# Altium schematic sheet PowerAndSafety.SchDoc
size A4; SheetNumber: 5; SheetTotal: 5
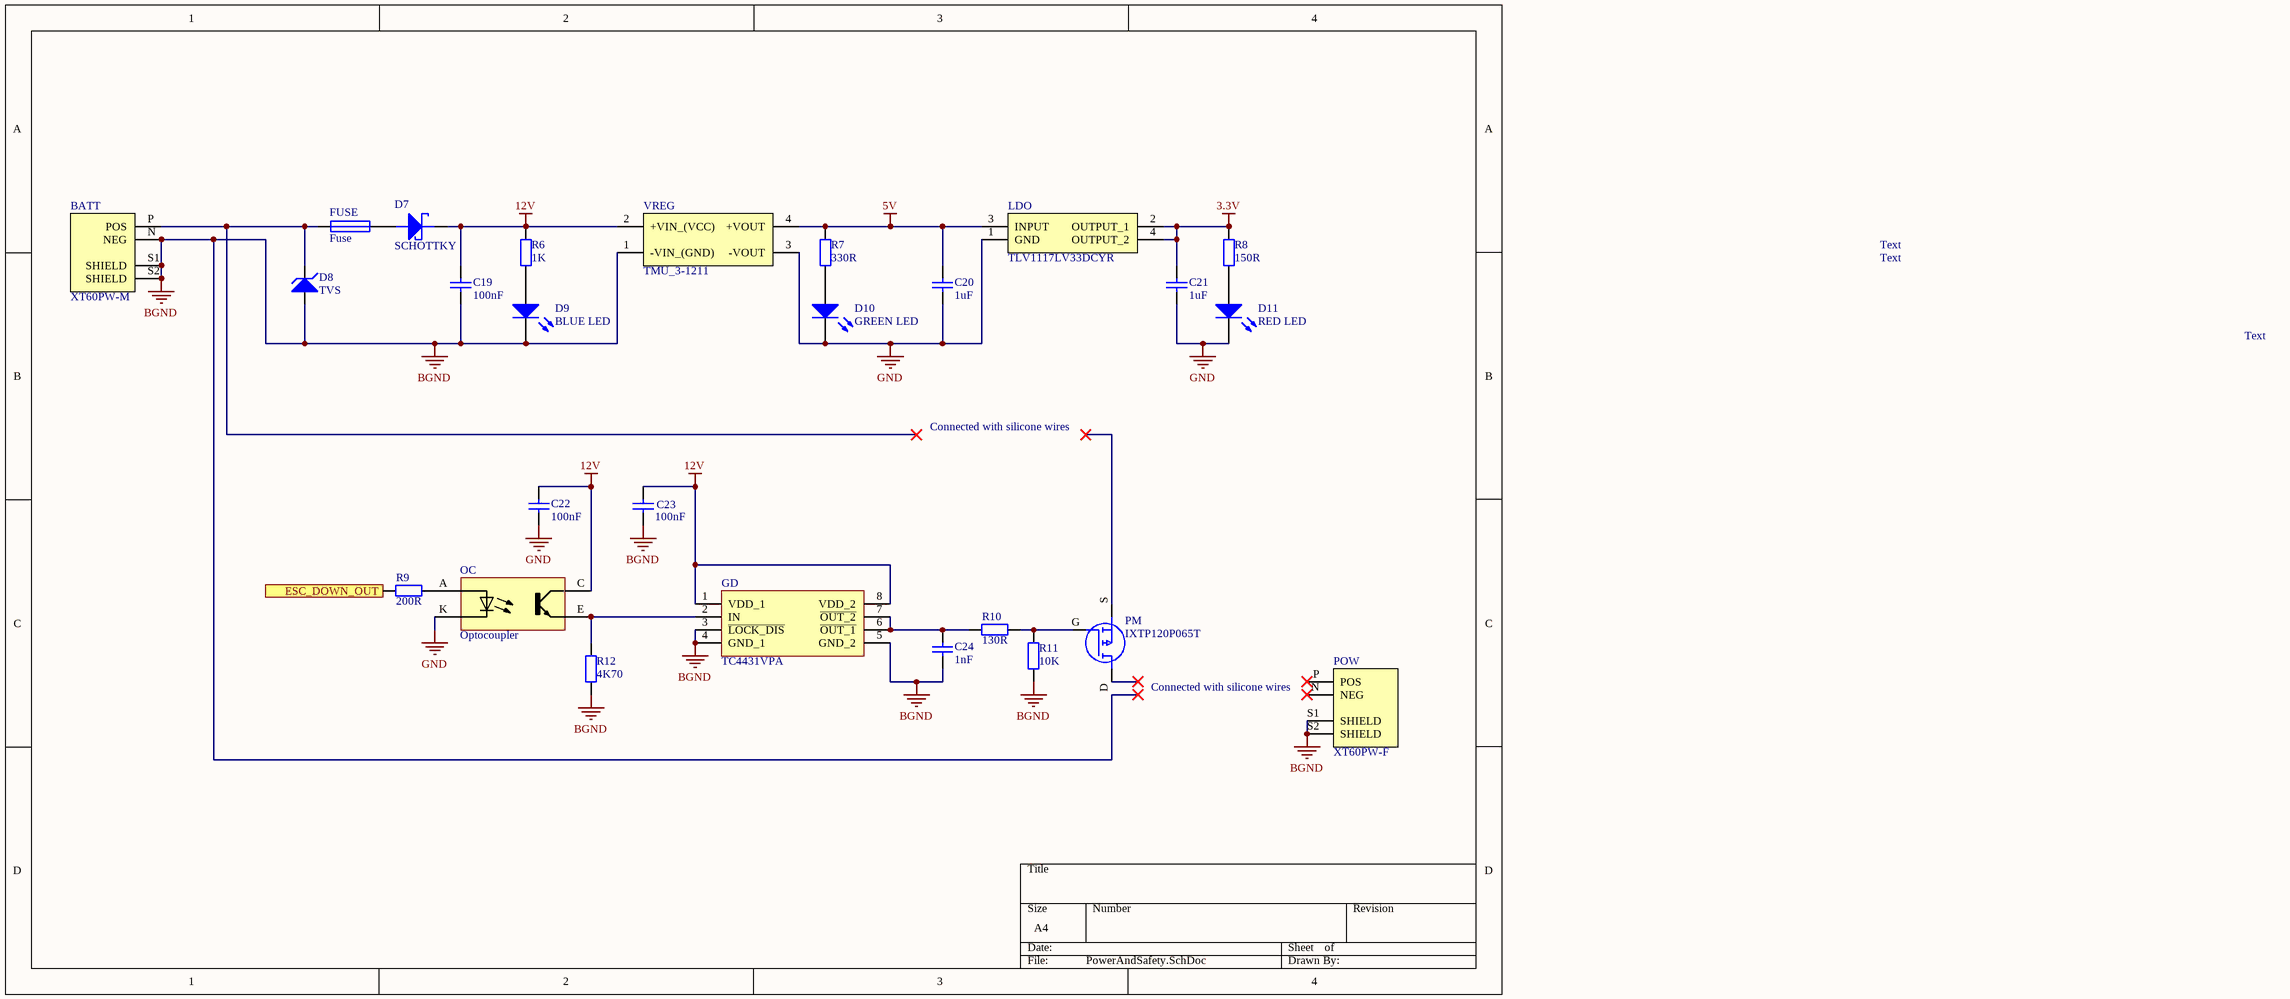
[diagram p0: PowerAndSafety.SchDoc]

## Parts
BATT  XT60PW-M  [AMASS_XT60PW-M]
C19  100nF  [FP_0805_CAP_085]
C20  1uF  [FP_0805_CAP_085]
C21  1uF  [FP_0805_CAP_085]
C22  100nF  [FP_0805_CAP_085]
C23  100nF  [FP_0805_CAP_085]
C24  1nF  [FP_0805_CAP_085]
D7  SCHOTTKY  [FP_SMA]
D8  TVS  [FP_SMB]
D9  BLUE LED  [LED_SMD_0805_BLUE]
D10  GREEN LED  [LED_SMD_0805_GREEN]
D11  RED LED  [LED_SMD_0805_RED]
FUSE  Fuse  [ECE BU110 PolyFuse]
GD  TC4431VPA  [DIP781W56P254L950H533Q8N]
LDO  TLV1117LV33DCYR  [SOT230P700X180-4N]
OC  Optocoupler  [SOP254P1016X400-4N]
PM  IXTP120P065T  [TO254P483X1028X2284-3P - extended]
POW  XT60PW-F  [AMASS_XT60PW-F]
R6  1K  [FP_0805_RES]
R7  330R  [FP_0805_RES]
R8  150R  [FP_0805_RES]
R9  200R  [FP_0805_RES]
R10  130R  [FP_0805_RES]
R11  10K  [FP_0805_RES]
R12  4K70  [FP_0805_RES]
VREG  TMU_3-1211  [TMU31211]

## Ports
ESC_DOWN_OUT (in)

## Nets
3.3V: C21.2 LDO.2(OUTPUT_1) LDO.4(OUTPUT_2) R8.2
5V: C20.2 LDO.3(INPUT) R7.2 VREG.4(+VOUT)
12V: C19.2 C22.1 C23.1 D7.K(CATHODE) GD.1(VDD_1) GD.8(VDD_2) OC.C R6.2 VREG.2(+VIN_(VCC))
BGND: BATT.N(NEG) BATT.S1(SHIELD) BATT.S2(SHIELD) C19.1 C23.2 C24.1 D8.A D9.K GD.3(~{LOCK_DIS}) GD.4(GND_1) GD.5(GND_2) POW.S1(SHIELD) POW.S2(SHIELD) R11.1 R12.1 VREG.1(-VIN_(GND))
GND: C20.1 C21.1 C22.2 D10.K D11.K LDO.1(GND) OC.K VREG.3(-VOUT)
ESC_DOWN_OUT: R9.2 ; port ESC_DOWN_OUT
NetBATT_P: BATT.P(POS) D8.K FUSE.1
NetC24_2: C24.2 GD.6(~{OUT_1}) GD.7(~{OUT_2}) R10.1
NetD7_A: D7.A(ANODE) FUSE.2
NetD9_A: D9.A R6.1
NetD10_A: D10.A R7.1
NetD11_A: D11.A R8.1
NetGD_2: GD.2(IN) OC.E R12.2
NetOC_A: OC.A R9.1
NetPM_G: PM.G(Gate) R10.2 R11.2

Not connected (* = marked no-connect by the designer): PM D(Drain)* S(Source)*; POW N(NEG)* P(POS)*

## Notes on the sheet
- Text
- Connected with silicone wires
- (near POW) Connected with silicone wires

## Library data of the parts
BATT = XT60PW-M: Socket, DC supply, male, PIN: 2; MF: AMASS; Check_prices: https://www.snapeda.com/parts/XT60PW-M/AMASS/view-part/?ref=eda; SnapEDA_Link: https://www.snapeda.com/parts/XT60PW-M/AMASS/view-part/?ref=snap; Price: None; Availability: Not in stock; Package: Package; MP: XT60PW-M; Value: *
C19-C24 = CAP: Capacitor
  C19 C22 C23: Value: 100nF
  C20 C21: Value: 1uF
  C24: Value: 1nF
D7 = SCHOTTKY: Schottky diode
D8 = ZENER: TVS Diode
D9-D11 = LED: Typical RED GaAs LED
GD = TC4431VPA: Microchip TC4431VPA, MOSFET Power Driver 1.5A, 4.5  30 V, Inverting, 8-Pin PDIP; Geometry.Height: 5.334mm; Mouser Part Number: 579-TC4431VPA; Mouser Price/Stock: https://www.mouser.co.uk/ProductDetail/Microchip-Technology/TC4431VPA?qs=dJbzCyn%252BCFb0mSWY4MWPfw%3D%3D; Manufacturer_Name: Microchip; Manufacturer_Part_Number: TC4431VPA; Datasheet Link: http://ww1.microchip.com/downloads/en/DeviceDoc/21424d.pdf
LDO = TLV1117LV33DCYR: 1-A, Positive Fixed Voltage, Low-Dropout Regulator; Manufacturer_Name: Texas Instruments; Geometry.Height: 1.8mm; Mouser Part Number: 595-TLV1117LV33DCYR; Mouser Price/Stock: https://www.mouser.co.uk/ProductDetail/Texas-Instruments/TLV1117LV33DCYR?qs=tEz3BkPb1rwzXMb8FiWhow%3D%3D; Manufacturer_Part_Number: TLV1117LV33DCYR; Datasheet Link: http://www.ti.com/lit/gpn/tlv1117lv
OC = Optocoupler: pin to pad: A>1 C>4 E>3 K>2; MP: VO615A-9X009T; Package: None; Price: None; Value: *; Availability: Unavailable
PM = IXTP120P065T: POWER MOSFET -120 Amps -65V 0.01 Rds; Manufacturer_Name: LITTELFUSE; Geometry.Height: 4.83mm; Mouser Part Number: 747-IXTP120P065T; Mouser Price/Stock: https://www.mouser.co.uk/ProductDetail/IXYS/IXTP120P065T?qs=cvHLLyFtoE09fNdm%2Fv8mrw%3D%3D; Manufacturer_Part_Number: IXTP120P065T; Datasheet Link: https://m.littelfuse.com/~/media/electronics/datasheets/discrete_mosfets/littelfuse_discrete_mosfets_p-channel_ixt_120p065t_datasheet.pdf.pdf
POW = XT60PW-F: Socket DC Supply Connector Female; MF: AMASS; SnapEDA_Link: https://www.snapeda.com/parts/XT60PW-F/AMASS/view-part/?ref=snap; Package: Package; Availability: Not in stock; Price: None; Check_prices: https://www.snapeda.com/parts/XT60PW-F/AMASS/view-part/?ref=eda; MP: XT60PW-F; Value: *
R6-R12 = RES: Resistor
  R6: Value: 1K
  R7: Value: 330R
  R8: Value: 150R
  R9: Value: 200R
  R10: Value: 130R
  R11: Value: 10K
  R12: Value: 4K70
VREG = TMU_3-1211: 3 Watt DC/DC converter, industrial, +/-10% input, short circuit protection, unregulated, encapsulated, SIP-4; Manufacturer_Name: Traco Power; Manufacturer_Part_Number: TMU 3-1211; Geometry.Height: 10.7mm; Mouser Part Number: 495-TMU3-1211; Mouser Price/Stock: https://www.mouser.co.uk/ProductDetail/TRACO-Power/TMU-3-1211?qs=By6Nw2ByBD3GesUHA2ql3Q%3D%3D; Datasheet Link: https://tracopower.com/tmu3-datasheet/